# EAGLE design 5947BreakOut00_orig (EAGLE 5.04)
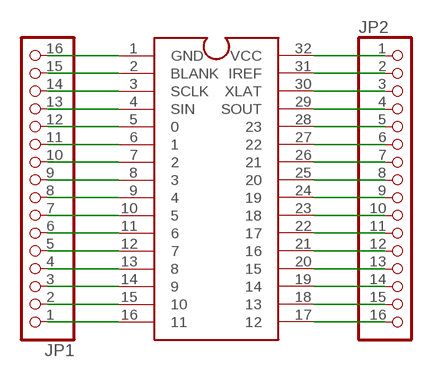
[diagram p0: schematic, sheet 1]

## Parts
JP1  PINHD-1X16  [1X16]
JP2  PINHD-1X16  [1X16]
U$1  TLC5947DAC  [DAP38]

## Nets
N$1: JP1.16 U$1.1(GND)
N$2: JP1.15 U$1.2(BLANK)
N$3: JP1.14 U$1.3(SCLK)
N$4: JP1.13 U$1.4(SIN)
N$5: JP1.12 U$1.5
N$6: JP1.11 U$1.6
N$7: JP1.10 U$1.7
N$8: JP1.9 U$1.8
N$9: JP1.8 U$1.9
N$10: JP1.7 U$1.10
N$11: JP1.6 U$1.11
N$12: JP1.5 U$1.12
N$13: JP1.4 U$1.13
N$14: JP1.3 U$1.14
N$15: JP1.2 U$1.15
N$16: JP1.1 U$1.16
N$17: JP2.1 U$1.32(VCC)
N$18: JP2.2 U$1.31(IREF)
N$19: JP2.3 U$1.30(XLAT)
N$20: JP2.4 U$1.29(SOUT)
N$21: JP2.5 U$1.28
N$22: JP2.6 U$1.27
N$23: JP2.7 U$1.26
N$24: JP2.8 U$1.25
N$25: JP2.9 U$1.24
N$26: JP2.10 U$1.23
N$27: JP2.11 U$1.22
N$28: JP2.12 U$1.21
N$29: JP2.13 U$1.20
N$30: JP2.14 U$1.19
N$31: JP2.15 U$1.18
N$32: JP2.16 U$1.17

## Library data of the parts
JP1 JP2 = pinhead:PINHD-1X16: PIN HEADER
U$1 = RazorConcepts:TLC5947DAC

## Board
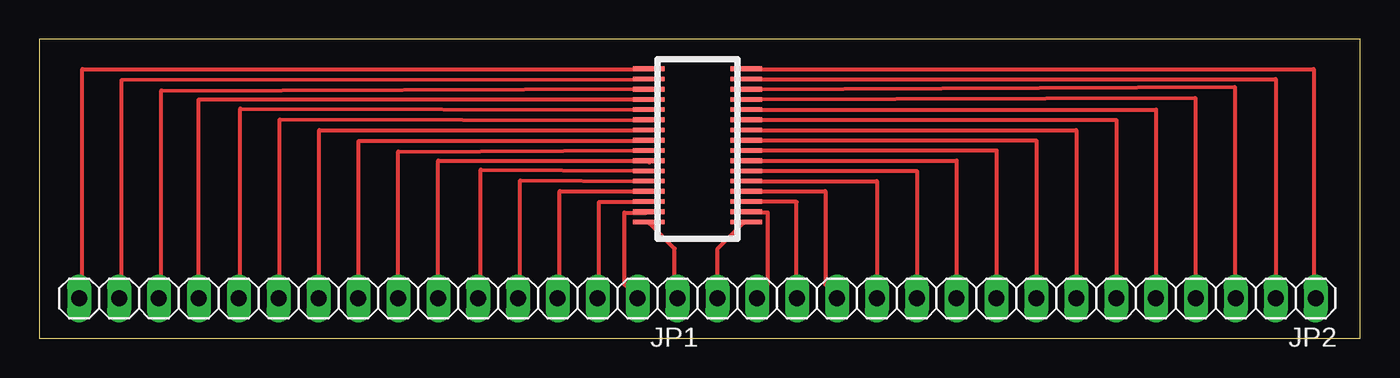
[diagram p1: board, top side]
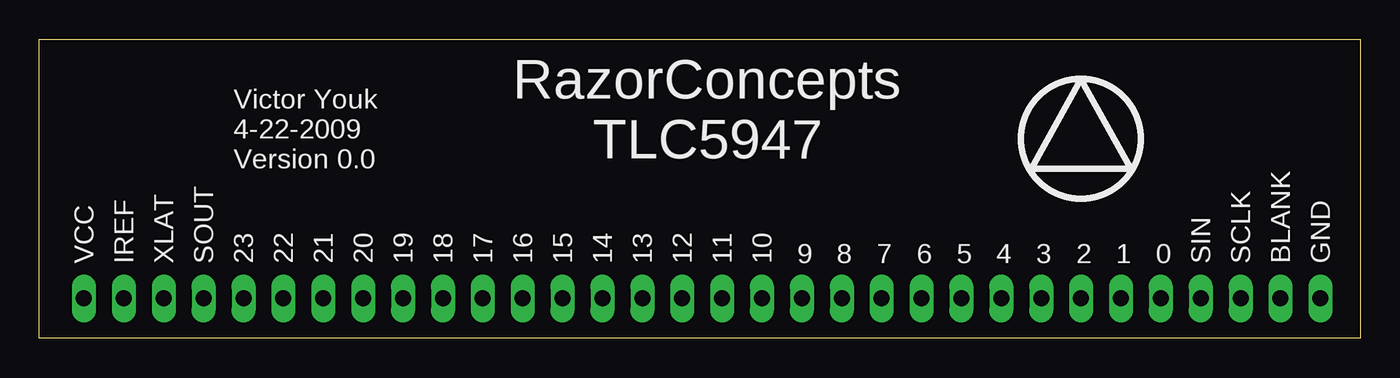
[diagram p2: board, bottom side, seen from below]

Size 84.12 x 19.04 mm. Coordinates in mm from the lower left corner, seen from the top.
Outline: 0,0 84.12,0 84.12,19.04 0,19.04 0,0
Copper layers (1*16): Top 0.035mm / dielectric 1.5mm / Bottom 0.035mm
Design rules "default": minimum track width 10mil, minimum drill 24mil, track to track 8mil, track to pad 8mil, pad to pad 8mil, via to via 8mil, smd to smd 8mil, copper to edge 40mil, drill to drill 8mil, minimum pad ring 10mil, minimum via ring 8mil, stop-mask expansion 4mil, vias tented up to drill 0mil, thermal gap 10mil

### Footprints (pad centres in the part's own frame; a part is rotated, then mirrored left to right if it is on the bottom)
1X16 = drill 1.016 long: 1 -19.05,0; 2 -16.51,0; 3 -13.97,0; 4 -11.43,0; 5 -8.89,0; 6 -6.35,0; 7 -3.81,0; 8 -1.27,0; 9 1.27,0; 10 3.81,0; 11 6.35,0; 12 8.89,0; 13 11.43,0; 14 13.97,0; 15 16.51,0; 16 19.05,0
DAP38 = smd 2 x 0.3: 1 -3.1,0.65; 2 -3.1,0; 3 -3.1,-0.65; 4 -3.1,-1.3; 5 -3.1,-1.95; 6 -3.1,-2.6; 7 -3.1,-3.25; 8 -3.1,-3.9; 9 -3.1,-4.55; 10 -3.1,-5.2; 11 -3.1,-5.85; 12 -3.1,-6.5; 13 -3.1,-7.15; 14 -3.1,-7.8; 15 -3.1,-8.45; 16 -3.1,-9.1; 17 3.1,-9.1; 18 3.1,-8.45; 19 3.1,-7.8; 20 3.1,-7.15; 21 3.1,-6.5; 22 3.1,-5.85; 23 3.1,-5.2; 24 3.1,-4.55; 25 3.1,-3.9; 26 3.1,-3.25; 27 3.1,-2.6; 28 3.1,-1.95; 29 3.1,-1.3; 30 3.1,-0.65; 31 3.1,0; 32 3.1,0.65

### Placement (x,y rotation side)
JP1  21.59,2.54 180 top
JP2  62.23,2.54 180 top
U$1  41.91,16.51 0 top

### Tracks (layer width: path | path; a pad name or v marks a point on that pad's centre or on a via)
N$1
  Top 0.254: U$1.1 38.63,17.14 2.74,17.14 2.74,2.74 JP1.16
N$2
  Top 0.254: U$1.2 38.63,16.51 5.26,16.46 5.26,2.74 JP1.15
N$3
  Top 0.254: U$1.3 38.61,15.88 7.77,15.77 7.77,2.74 JP1.14
N$4
  Top 0.254: 39.04,15.19 U$1.4 10.16,15.21 JP1.13
  Bottom 0.254: JP1.13 10.29,2.74
N$5
  Top 0.254: U$1.5 38.61,14.55 12.8,14.63 12.8,2.74 JP1.12
N$6
  Top 0.254: U$1.6 38.61,13.89 15.32,13.95 15.32,2.74 JP1.11
N$7
  Top 0.254: U$1.7 38.63,13.26 17.83,13.26 17.83,2.74 JP1.10
N$8
  Top 0.254: U$1.8 38.63,12.57 20.34,12.57 20.34,2.74 JP1.9
N$9
  Top 0.254: U$1.9 38.63,11.96 22.86,11.89 JP1.8
N$10
  Top 0.254: 38.86,11.2 U$1.10 25.4,11.31 JP1.7
N$11
  Top 0.254: U$1.11 38.56,10.67 28.12,10.74 28.12,2.74 JP1.6
N$12
  Top 0.254: U$1.12 38.56,10.01 30.63,10.06 30.63,2.74 JP1.5
N$13
  Top 0.254: U$1.13 38.63,9.37 33.15,9.37 33.15,2.74 JP1.4
N$14
  Top 0.254: U$1.14 38.63,8.69 35.66,8.69 35.66,2.74 JP1.3
N$15
  Top 0.254: U$1.15 38.63,8 37.26,8 37.26,3.43 37.95,2.74 JP1.2
N$16
  Top 0.254: U$1.16 38.86,7.32 40.46,5.71 40.46,2.74 JP1.1
N$17
  Top 0.254: U$1.32 45.03,17.14 81.15,17.14 81.15,2.74 JP2.1
N$18
  Top 0.254: 44.78,16.51 U$1.31 78.74,16.51 JP2.2
  Bottom 0.254: JP2.2 78.64,2.74
N$19
  Top 0.254: U$1.30 45.03,15.85 76.12,16 76.12,2.74 JP2.3
N$20
  Top 0.254: U$1.29 45.03,15.21 73.61,15.32 73.61,2.74 JP2.4
N$21
  Top 0.254: 45.03,14.55 U$1.28 71.12,14.56 JP2.5 71.09,2.74
N$22
  Top 0.254: U$1.27 68.58,13.91 JP2.6
N$23
  Top 0.254: U$1.26 66.04,13.26 JP2.7
N$24
  Top 0.254: 63.32,2.74 JP2.8 63.5,12.61 U$1.25
N$25
  Top 0.254: U$1.24 60.96,11.96 JP2.9
N$26
  Top 0.254: U$1.23 58.42,11.31 JP2.10
N$27
  Top 0.254: U$1.22 55.88,10.66 JP2.11
N$28
  Top 0.254: U$1.21 53.34,10.01 JP2.12
  Bottom 0.254: JP2.12 53.26,2.74
N$29
  Top 0.254: U$1.20 45.03,9.37 50.06,9.37 50.06,3.43 50.75,2.74 JP2.13
N$30
  Top 0.254: U$1.19 45.03,8.69 48.23,8.69 48.23,2.74 JP2.14
N$31
  Top 0.254: U$1.18 45.03,8 46.41,8 46.41,3.43 45.72,2.74 JP2.15
N$32
  Top 0.254: U$1.17 44.81,7.32 43.2,5.71 43.2,2.74 JP2.16

### Text on the board
bPlace: RazorConcepts | Victor Youk | 4-22-2009 | TLC5947 | Version 0.0 | GND | BLANK | SCLK | SIN | 0 | 1 | 2 | 3 | 4 | 5 | 6 | 7 | 8 | 9 | 10 | 11 | 12 | 13 | 14 | 15 | 16 | 17 | 18 | 19 | 20 | 21 | 22 | 23 | SOUT | XLAT | IREF | VCC